# EAGLE design schematic (EAGLE 9.5.2)
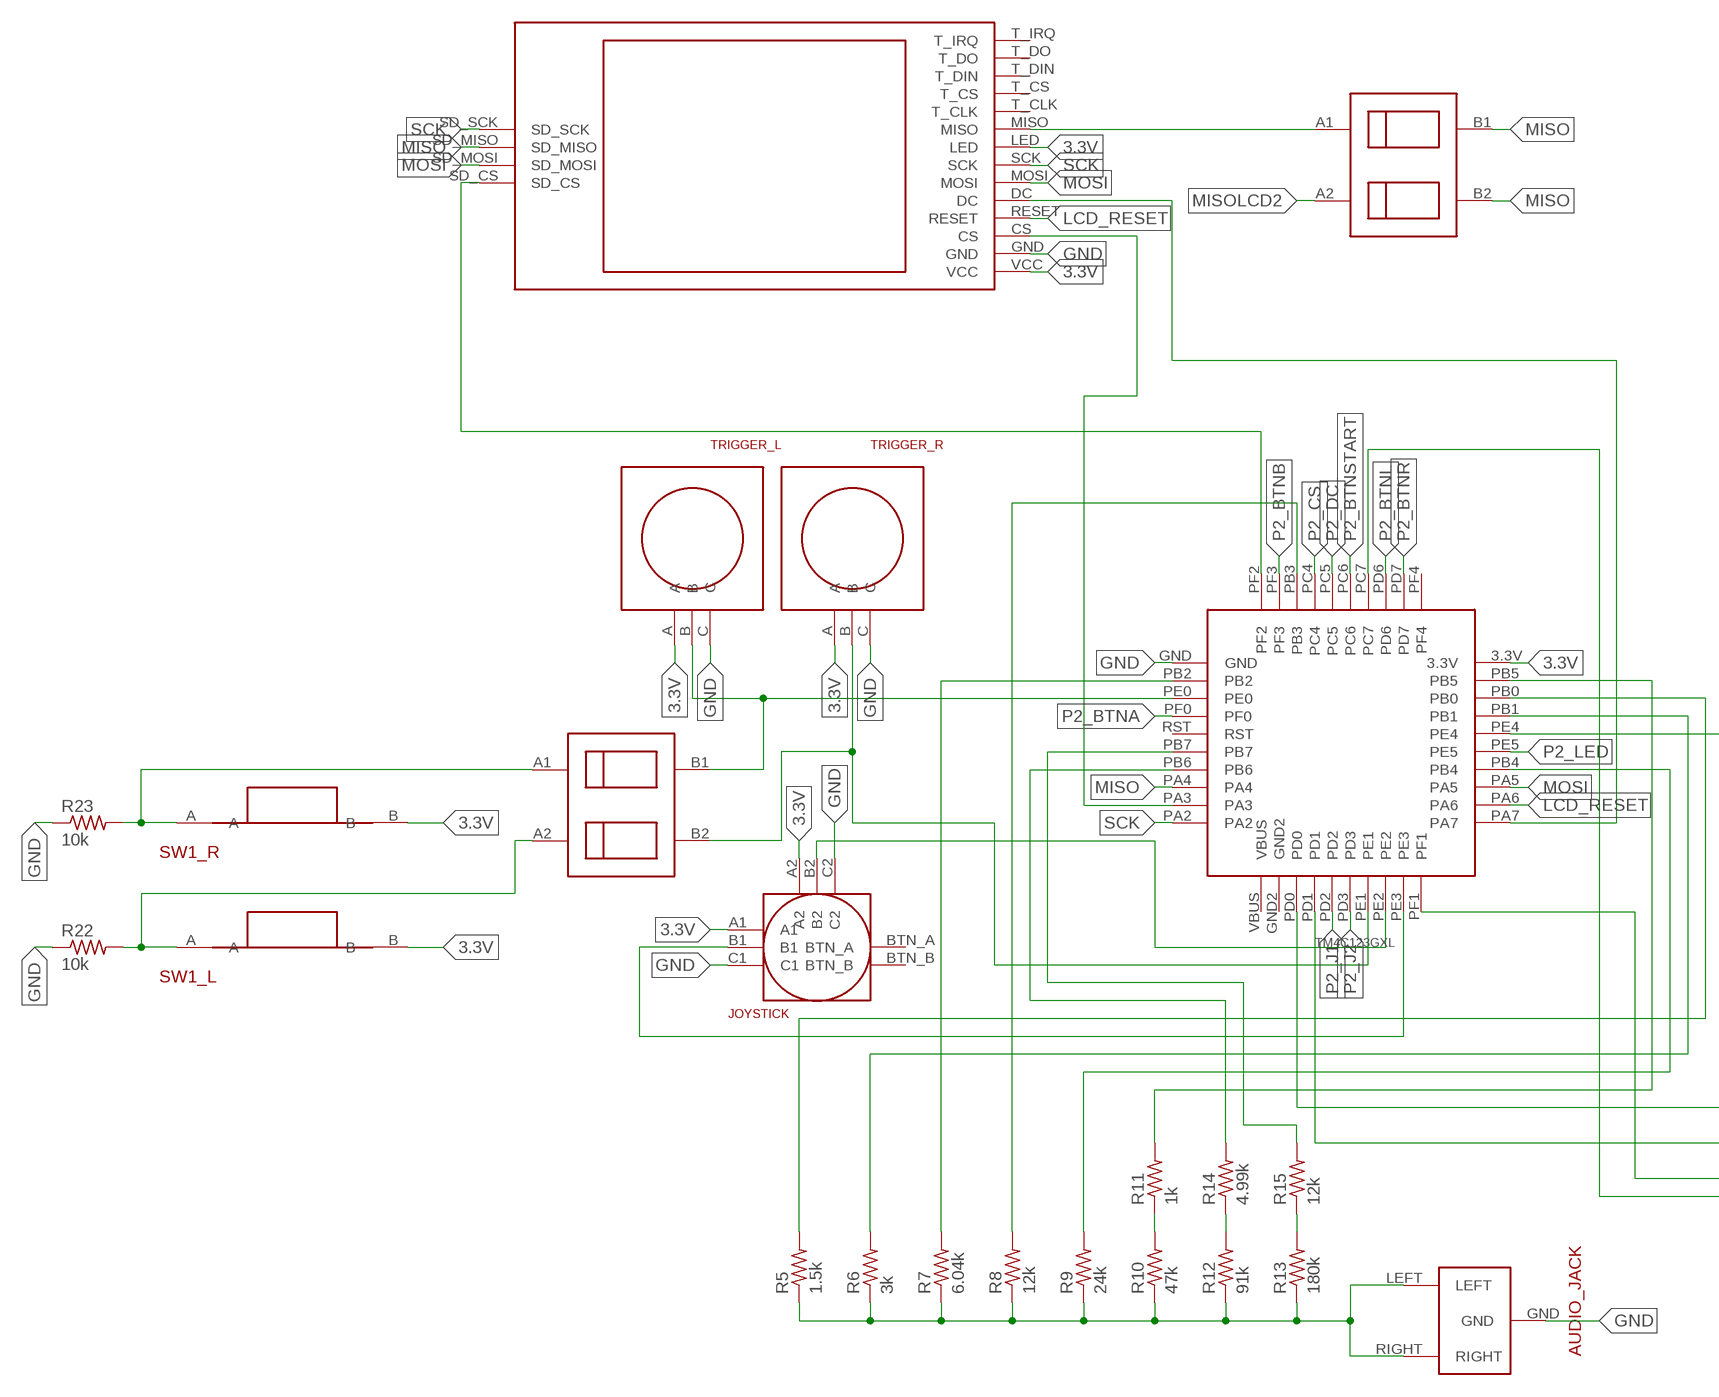
[diagram p0: schematic, sheet 1, part 1 of 2]
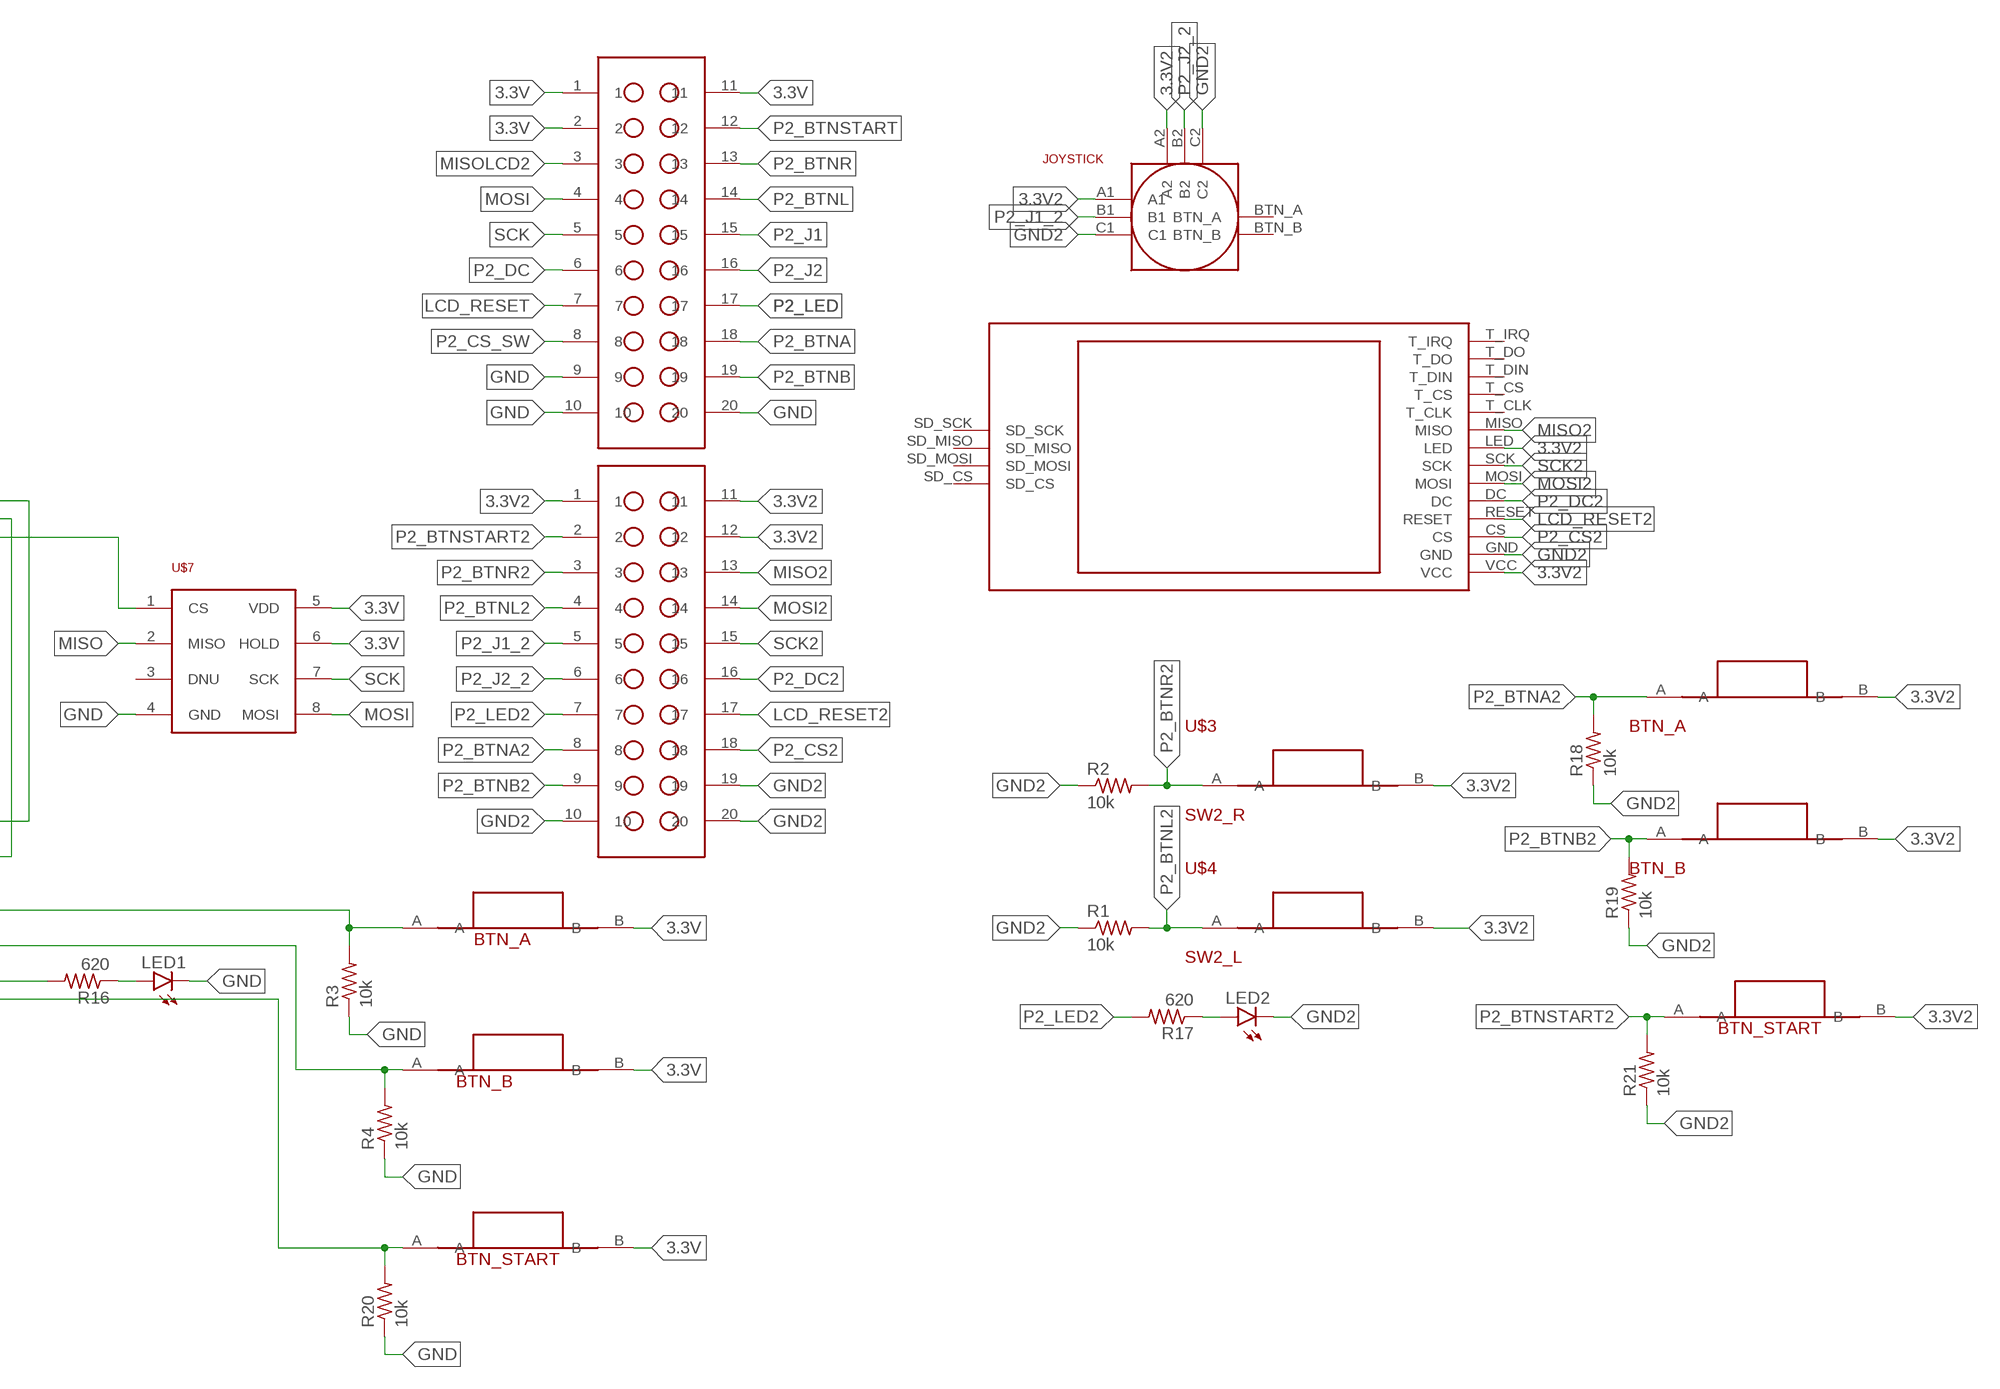
[diagram p1: schematic, sheet 1, part 2 of 2]

## Parts
LED1  LEDCHIPLED_1206  [CHIPLED_1206]
LED2  LEDCHIPLED_1206  [CHIPLED_1206]
P1_LCD  ILI9341  [ILI9341]
P2_LCD  ILI9341  [ILI9341]
R1  10k  R-US_R0805  [R0805]
R2  10k  R-US_R0805  [R0805]
R3  10k  R-US_R0805  [R0805]
R4  10k  R-US_R0805  [R0805]
R5  1.5k  R-US_R0805  [R0805]
R6  3k  R-US_R0805  [R0805]
R7  6.04k  R-US_R0805  [R0805]
R8  12k  R-US_R0805  [R0805]
R9  24k  R-US_R0805  [R0805]
R10  47k  R-US_R0805  [R0805]
R11  1k  R-US_R0805  [R0805]
R12  91k  R-US_R0805  [R0805]
R13  180k  R-US_R0805  [R0805]
R14  4.99k  R-US_R0805  [R0805]
R15  12k  R-US_R0805  [R0805]
R16  620  R-US_R0805  [R0805]
R17  620  R-US_R0805  [R0805]
R18  10k  R-US_R0805  [R0805]
R19  10k  R-US_R0805  [R0805]
R20  10k  R-US_R0805  [R0805]
R21  10k  R-US_R0805  [R0805]
R22  10k  R-US_R0805  [R0805]
R23  10k  R-US_R0805  [R0805]
U$1  TM4C123GXL  [TM4C123GXL]
U$2  JOYSTICK  [JOYSTICK]
U$3  SW2_R  SW-1825968-2  [SW-1825968-2]
U$4  SW2_L  SW-1825968-2  [SW-1825968-2]
U$5  TRIGGER_L  [TRIGGER_L]
U$6  TRIGGER_R  [TRIGGER_R]
U$7  IS62WVS5128FALL-16NLI  [SOIC127P600X144-8]
U$8  BTN_A  BUTTON  [BUTTON]
U$9  BTN_B  BUTTON  [BUTTON]
U$10  AUDIO_JACK  [AUDIO_JACK]
U$11  10X2_HEADER  [10X2_HEADER]
U$12  10X2_HEADER  [10X2_HEADER]
U$13  JOYSTICK  [JOYSTICK]
U$14  BTN_A  BUTTON  [BUTTON]
U$15  BTN_B  BUTTON  [BUTTON]
U$16  BTN_START  BUTTON  [BUTTON]
U$17  BTN_START  BUTTON  [BUTTON]
U$18  SW1_R  SW-1825968-2  [SW-1825968-2]
U$19  SW1_L  SW-1825968-2  [SW-1825968-2]
U$20  DIPSW-2  [DIPSW-2]
U$21  DIPSW-2  [DIPSW-2]

## Nets
3.3V: P1_LCD.LED P1_LCD.VCC U$1.3.3V U$2.A1 U$2.A2 U$5.A U$6.A U$7.5(VDD) U$7.6(HOLD) U$8.B U$9.B U$11.1 U$11.2 U$11.11 U$16.B U$18.B U$19.B
3.3V2: P2_LCD.LED P2_LCD.VCC U$3.B U$4.B U$12.1 U$12.11 U$12.12 U$13.A1 U$13.A2 U$14.B U$15.B U$17.B
GND: LED1.C P1_LCD.GND R3.1 R4.1 R20.1 R22.1 R23.1 U$1.GND U$2.C1 U$2.C2 U$5.C U$6.C U$7.4(GND) U$10.GND U$11.9 U$11.10 U$11.20
GND2: LED2.C P2_LCD.GND R1.1 R2.1 R18.1 R19.1 R21.1 U$12.10 U$12.19 U$12.20 U$13.C1 U$13.C2
LCD_RESET: P1_LCD.RESET U$1.PA6 U$11.7
LCD_RESET2: P2_LCD.RESET U$12.17
MISO: P1_LCD.SD_MISO U$1.PA4 U$7.2(MISO) U$21.B1 U$21.B2
MISO2: P2_LCD.MISO U$12.13
MISOLCD1: P1_LCD.MISO U$21.A1
MISOLCD2: U$11.3 U$21.A2
MOSI: P1_LCD.MOSI P1_LCD.SD_MOSI U$1.PA5 U$7.8(MOSI) U$11.4
MOSI2: P2_LCD.MOSI U$12.14
N$1: U$1.PE4 U$7.1(CS)
N$2: U$1.PE0 U$5.B U$20.B1
N$3: P1_LCD.CS U$1.PA3
N$4: U$1.PE2 U$2.B2
N$5: U$1.PE1 U$6.B U$20.B2
N$6: R16.2 U$1.PF1
N$7: R4.2 U$1.PD1 U$9.A
N$8: R10.2 R11.1
N$9: LED2.A R17.1
N$11: R12.2 R14.1
N$12: R20.2 U$1.PC7 U$16.A
N$14: P1_LCD.DC U$1.PA7
N$17: R13.2 R15.1
N$18: R5.1 R6.1 R7.1 R8.1 R9.1 R10.1 R12.1 R13.1 U$10.LEFT U$10.RIGHT
N$19: R5.2 U$1.PB0
N$20: R6.2 U$1.PB1
N$21: R7.2 U$1.PB2
N$22: R8.2 U$1.PB3
N$23: R9.2 U$1.PB4
N$24: R11.2 U$1.PB5
N$25: R14.2 U$1.PB6
N$26: R15.2 U$1.PB7
N$27: R3.2 U$1.PD0 U$8.A
N$29: LED1.A R16.1
N$30: U$1.PE3 U$2.B1
N$31: P1_LCD.SD_CS U$1.PF2
P1_BTN_L: R22.2 U$19.A U$20.A2
P1_BTN_R: R23.2 U$18.A U$20.A1
P2_BTNA: U$1.PF0 U$11.18
P2_BTNA2: R18.2 U$12.8 U$14.A
P2_BTNB: U$1.PF3 U$11.19
P2_BTNB2: R19.2 U$12.9 U$15.A
P2_BTNL: U$1.PD6 U$11.14
P2_BTNL2: R1.2 U$4.A U$12.4
P2_BTNR: U$1.PD7 U$11.13
P2_BTNR2: R2.2 U$3.A U$12.3
P2_BTNSTART: U$1.PC6 U$11.12
P2_BTNSTART2: R21.2 U$12.2 U$17.A
P2_CS: U$1.PC4
P2_CS2: P2_LCD.CS U$12.18
P2_CS_SW: U$11.8
P2_DC: U$1.PC5 U$11.6
P2_DC2: P2_LCD.DC U$12.16
P2_J1: U$1.PD2 U$11.15
P2_J1_2: U$12.5 U$13.B1
P2_J2: U$1.PD3 U$11.16
P2_J2_2: U$12.6 U$13.B2
P2_LED: U$1.PE5 U$11.17
P2_LED2: R17.2 U$12.7
SCK: P1_LCD.SCK P1_LCD.SD_SCK U$1.PA2 U$7.7(SCK) U$11.5
SCK2: P2_LCD.SCK U$12.15
Unconnected: P1_LCD.T_CLK P1_LCD.T_CS P1_LCD.T_DIN P1_LCD.T_DO P1_LCD.T_IRQ P2_LCD.SD_CS P2_LCD.SD_MISO P2_LCD.SD_MOSI P2_LCD.SD_SCK P2_LCD.T_CLK P2_LCD.T_CS P2_LCD.T_DIN P2_LCD.T_DO P2_LCD.T_IRQ U$1.GND2 U$1.PF4 U$1.RST U$1.VBUS U$2.BTN_A U$2.BTN_B U$7.3(DNU) U$13.BTN_A U$13.BTN_B

## Library data of the parts
LED1 LED2 = led:LED: LED OSRAM: - CHIPLED LG R971, LG N971, LY N971, LG Q971, LY Q971, LO R971, LY R971 LH N974, LH R974 LS Q976, LO Q976, LY Q976 LO Q996 - Hyper CHIPLED LW Q18S LB Q993, LB Q99A, LB R99A - SideLED LS A670, LO A670, LY A670, LG A670, LP A670 LB A673, LV A673, LT A673, LW A673 LH A674 LY A675 LS A676, LA A676, LO A676, LY A676, LW A676 LS A679, LY A679, LG A679 - Hyper Micro SIDELED® LS Y876, LA Y876, LO Y876, LY Y876 LT Y87S - SmartLED LW L88C, LW L88S LB L89C, LB L89S, LG L890 LS L89K, LO L89K, LY L89K LS L896, LA L896, LO L896, LY L896 - TOPLED LS T670, LO T670, LY T670, LG T670, LP T670 LSG T670, LSP T670, LSY T670, LOP T670, LYG T670 LG T671, LOG T671, LSG T671 LB T673, LV T673, LT T673, LW T673 LH T674 LS T676, LA T676, LO T676, LY T676, LB T676, LH T676, LSB T676, LW T676 LB T67C, LV T67C, LT T67C, LS T67K, LO T67K, LY T67K, LW E67C LS E67B, LA E67B, LO E67B, LY E67B, LB E67C, LV E67C, LT E67C LW T67C LS T679, LY T679, LG T679 LS T770, LO T770, LY T770, LG T770, LP T770 LB T773, LV T773, LT T773, LW T773 LH T774 LS E675, LA E675, LY E675, LS T675 LS T776, LA T776, LO T776, LY T776, LB T776 LHGB T686 LT T68C, LB T68C - Hyper Mini TOPLED® LB M676 - Mini TOPLED Santana® LG M470 LS M47K, LO M47K, LY M47K Source: http://www.osram.convergy.de LUXEON: - LUMILED® LXK2-PW12-R00, LXK2-PW12-S00, LXK2-PW14-U00, LXK2-PW14-V00 LXK2-PM12-R00, LXK2-PM12-S00, LXK2-PM14-U00 LXK2-PE12-Q00, LXK2-PE12-R00, LXK2-PE12-S00, LXK2-PE14-T00, LXK2-PE14-U00 LXK2-PB12-K00, LXK2-PB12-L00, LXK2-PB12-M00, LXK2-PB14-N00, LXK2-PB14-P00, LXK2-PB14-Q00 LXK2-PR12-L00, LXK2-PR12-M00, LXK2-PR14-Q00, LXK2-PR14-R00 LXK2-PD12-Q00, LXK2-PD12-R00, LXK2-PD12-S00 LXK2-PH12-R00, LXK2-PH12-S00 LXK2-PL12-P00, LXK2-PL12-Q00, LXK2-PL12-R00 Source: www.luxeon.com KINGBRIGHT: KA-3528ASYC Source: www.kingbright.com
P1_LCD P2_LCD = 319H Final Project:ILI9341
R1-R23 = rcl:R-US_: RESISTOR, American symbol; SPICEPREFIX: R
U$1 = 319H Final Project:TM4C123GXL
U$2 U$13 = 319H Final Project:JOYSTICK
U$3 U$4 U$18 U$19 = 319H Final Project:SW-1825968-2
U$5 = 319H Final Project:TRIGGER_L
U$6 = 319H Final Project:TRIGGER_R
U$7 = 319H Final Project:IS62WVS5128FALL-16NLI
U$8 U$9 U$14-U$17 = 319H Final Project:BUTTON
U$10 = 319H Final Project:AUDIO_JACK
U$11 U$12 = 319H Final Project:10X2_HEADER
U$20 U$21 = 319H Final Project:DIPSW-2

## Board
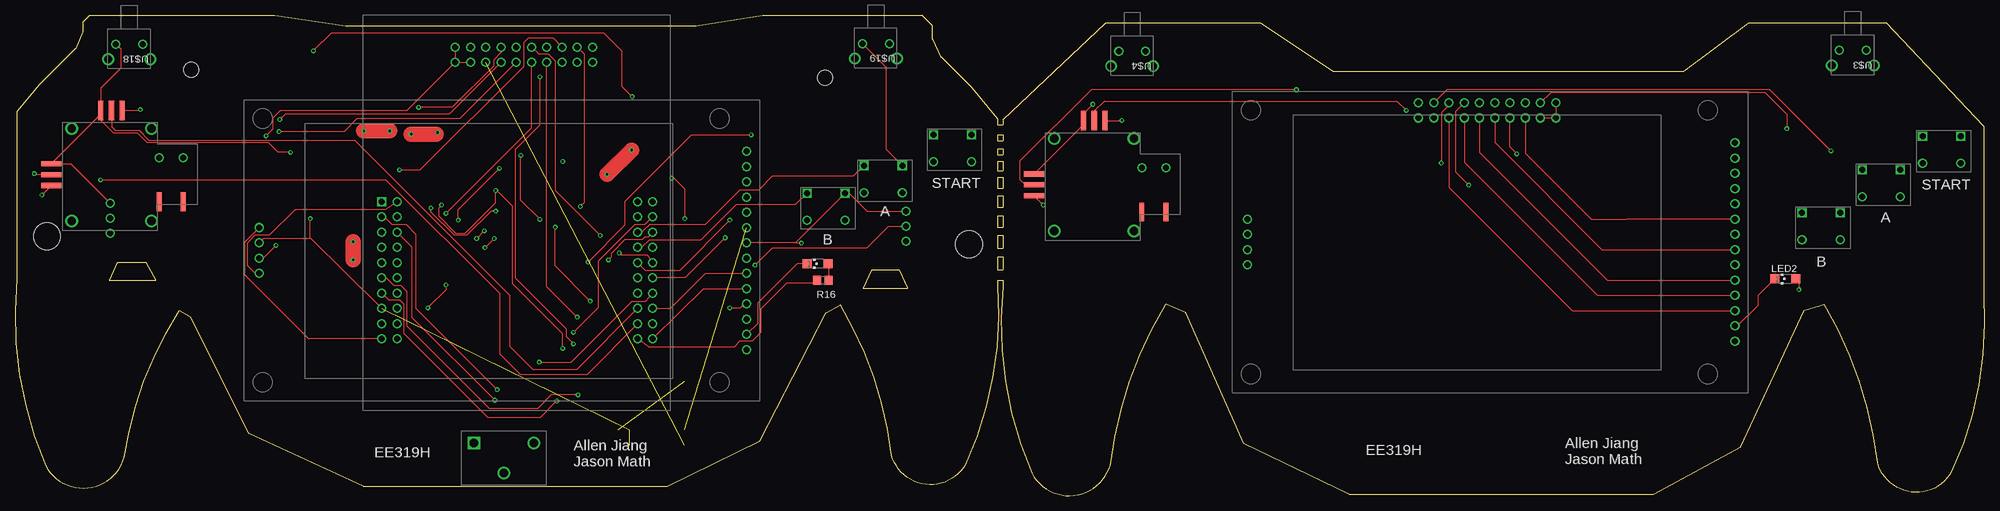
[diagram p2: board, top side]
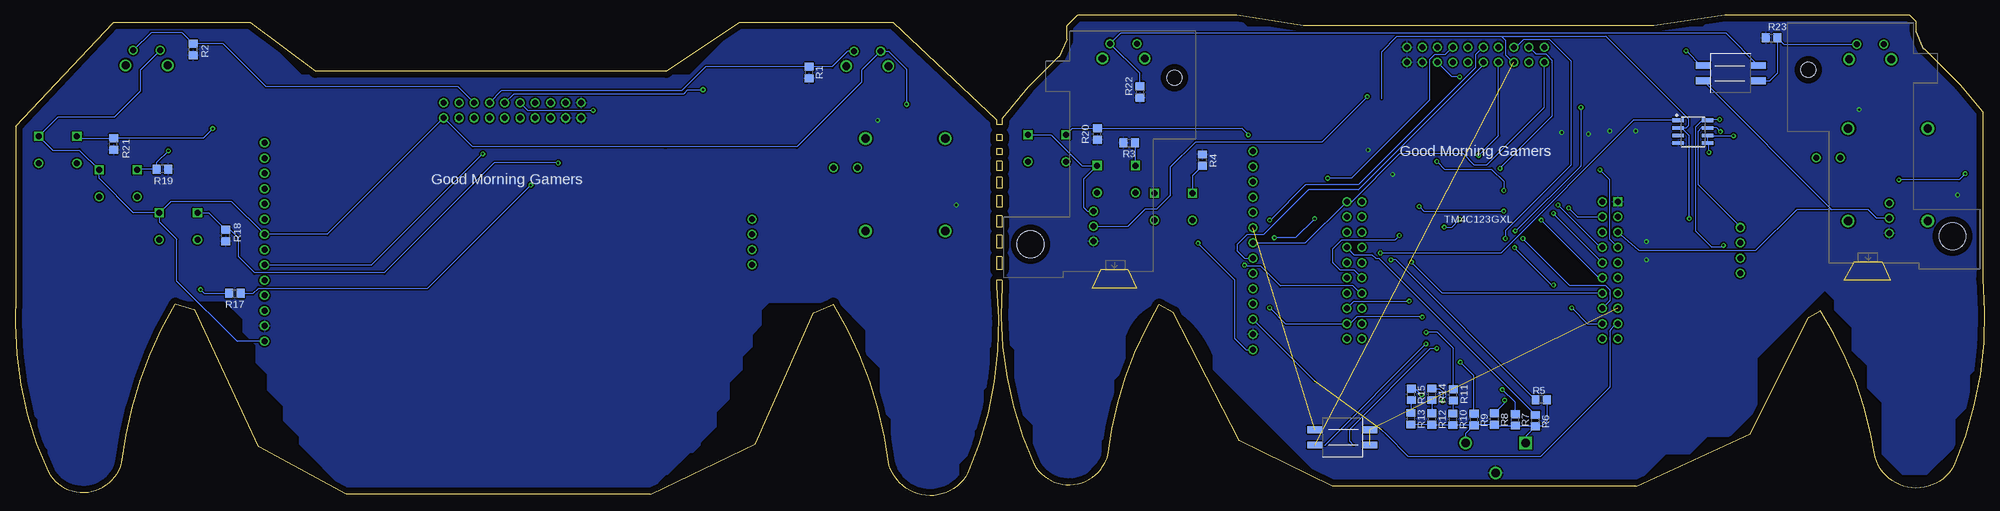
[diagram p3: board, bottom side, seen from below]

Size 327.98 x 80.03 mm. Coordinates in mm from the lower left corner, seen from the top.
Outline: 152.82,78.25 151.04,80.03 124.5,80.03 113.45,78.25 55.03,78.25 43.22,80.03 12.48,80.03 11.34,78.89 11.34,77.24 10.2,74.44 10.07,74.44 4.1,68.47 0.29,63.9 0.29,36.09 arc29 5.12,4.97 arc135 18.2,6.37 arc-24 27.34,30.75 29.25,29.74 39.03,10.31 57.95,1.54 108.62,1.54 124.12,9.16 135.04,30.5 137.45,31.77 arc-24 145.96,6.75 arc135 158.28,5.23 arc29 163.61,34.95 163.61,35.83 164.5,35.83 164.5,34.82 arc29 169.33,3.7 arc135 182.41,5.1 arc-24 191.68,31.9 194.98,30.5 204.63,8.66 222.16,0.27 272.83,0.27 287.44,8.15 297.98,30.88 301.28,31.9 arc-24 310.17,5.48 arc135 322.49,3.96 arc29 327.82,33.68 327.82,61.49 311.65,78.76 288.71,78.76 277.91,70.63 219.49,70.63 207.43,78.76 181.65,78.76 164.5,62.63 164.5,61.74 163.61,61.74 163.61,62.76 159.29,67.97 154.21,73.05 154.09,73.05 152.82,75.97 152.82,78.25
Outline: 163.61,60.09 163.61,59.08 164.5,59.08 164.5,60.09 163.61,60.09
Outline: 163.61,57.81 163.61,56.79 164.5,56.79 164.5,57.81 163.61,57.81
Outline: 163.61,55.65 163.61,54.12 164.5,54.12 164.5,55.65 163.61,55.65
Outline: 163.61,52.98 163.61,51.2 164.5,51.2 164.5,52.98 163.61,52.98
Outline: 163.61,49.93 163.61,48.03 164.5,48.03 164.5,49.93 163.61,49.93
Outline: 163.61,46.63 163.61,44.72 164.5,44.72 164.5,46.63 163.61,46.63
Outline: 163.61,43.33 163.61,41.17 164.5,41.17 164.5,43.33 163.61,43.33
Outline: 163.61,39.77 163.61,37.61 164.5,37.61 164.5,39.77 163.61,39.77
Copper layers (1*16): Top 0.035mm / dielectric 1.5mm / Bottom 0.035mm
Design rules "default *": minimum track width 6mil, minimum drill 0.35mm, track to track 10mil, track to pad 10mil, pad to pad 10mil, via to via 10mil, smd to smd 10mil, copper to edge 40mil, drill to drill 6mil, minimum pad ring 10mil, minimum via ring 8mil, stop-mask expansion 4mil, vias tented up to drill 0mil, thermal gap 10mil
Milling: 8 lines

### Footprints (pad centres in the part's own frame; a part is rotated, then mirrored left to right if it is on the bottom)
CHIPLED_1206 = smd 1.5 x 1.5: A 0,-1.75; C 0,1.75
ILI9341 = drill 1: CS 83.713,13.635; DC 83.713,18.715; GND 83.713,11.095; LED 83.713,26.335; MISO 83.713,28.875; MOSI 83.713,21.255; RESET 83.713,16.175; SCK 83.713,23.795; SD_CS 2.538,21.261; SD_MISO 2.538,26.341; SD_MOSI 2.538,23.801; SD_SCK 2.538,28.881; T_CLK 83.713,31.415; T_CS 83.713,33.955; T_DIN 83.713,36.495; T_DO 83.713,39.035; T_IRQ 83.713,41.575; VCC 83.713,8.555
R0805 = smd 1.3 x 1.5: 1 -0.95,0; 2 0.95,0
TM4C123GXL = drill 1: 3.3V 21.367,-0.127; GND2 18.827,-2.667; PA2 -23.749,-22.987; PA3 -23.749,-20.447; PA4 -23.749,-17.907; PA5 21.367,-17.907; PA6 21.367,-20.447; PA7 21.367,-22.987; PB0 21.367,-5.207; PB1 21.367,-7.747; PB2 -23.749,-2.667; PB3 -21.209,-5.207; PB4 21.367,-15.367; PB5 21.367,-2.667; PB6 -23.749,-15.367; PB7 -23.749,-12.827; PC4 -21.209,-7.747; PC5 -21.209,-10.287; PC6 -21.209,-12.827; PC7 -21.209,-15.367; PD0 18.827,-5.207; PD1 18.827,-7.747; PD2 18.827,-10.287; PD3 18.827,-12.827; PD6 -21.209,-17.907; PD7 -21.209,-20.447; PE0 -23.749,-5.207; PE1 18.827,-15.367; PE2 18.827,-17.907; PE3 18.827,-20.447; PE4 21.367,-10.287; PE5 21.367,-12.827; PF0 -23.749,-7.747; PF1 18.827,-22.987; PF2 -21.209,-0.127; PF3 -21.209,-2.667; PF4 -21.209,-22.987; RST -23.749,-10.287; VBUS 18.827,-0.127 | drill 1 square: GND -23.749,-0.127
JOYSTICK = smd 3.3 x 0.86: A1 -10.3,1.72; B1 -10.3,-0.08; C1 -10.3,-1.88 | smd 0.86 x 3.3: A2 -2.075,10.62; B2 -0.275,10.62; C2 1.525,10.62 | smd 0.8 x 3.1: BTN_A 7.65,-4.58; BTN_B 11.65,-4.58 | drill 1.4: P$1 6.35,7.62; P$2 -6.9,7.62; P$3 6.35,-7.78; P$4 -6.9,-7.78 | drill 1: P$11 7.65,2.77; P$12 11.65,2.77
SW-1825968-2 = drill 1.295: 3 -3.2,2.54; 4 3.81,2.54 | drill 1: A -1.93,0.051; B 2.54,0.051
TRIGGER_L = drill 1: A 1.27,-7.7; B 1.27,-10.2; C 1.27,-12.7 | hole 2.5: -12.23,14.5 | hole 4.5: 11.77,-13.2
TRIGGER_R = drill 1: A -3.81,-7.7; B -3.81,-10.2; C -3.81,-12.7 | hole 2.5: 9.69,14.5 | hole 4.5: -14.31,-13.2
SOIC127P600X144-8 = smd 1.901 x 0.599: 1 -2.455,1.905; 2 -2.455,0.635; 3 -2.455,-0.635; 4 -2.455,-1.905; 5 2.455,-1.905; 6 2.455,-0.635; 7 2.455,0.635; 8 2.455,1.905
BUTTON = drill 1 square: A -3.81,2.54; B 2.54,2.54 | drill 1: P$3 -3.81,-1.96; P$4 2.54,-1.96
AUDIO_JACK = drill 1.4: GND 0,-2.54; LEFT 5,2.46 | drill 1.4 square: RIGHT -5,2.46
10X2_HEADER = drill 1: 1 -1.27,11.557; 2 -1.27,9.017; 3 -1.27,6.477; 4 -1.27,3.937; 5 -1.27,1.397; 6 -1.27,-1.143; 7 -1.27,-3.683; 8 -1.27,-6.223; 9 -1.27,-8.763; 10 -1.27,-11.303; 11 1.27,11.557; 12 1.27,9.017; 13 1.27,6.477; 14 1.27,3.937; 15 1.27,1.397; 16 1.27,-1.143; 17 1.27,-3.683; 18 1.27,-6.223; 19 1.27,-8.763; 20 1.27,-11.303
DIPSW-2 = smd 1.12 x 2.44: A1 -1.805,-5.08; A2 0.735,-5.08; B1 -1.805,4.14; B2 0.735,4.14

### Placement (x,y rotation side)
LED1  133.64,38.63 90 top
LED2  294.8,36.09 90 top
P1_LCD  38.14,15.77 0 top
P2_LCD  202.73,17.17 0 top
R1  195.73,70.46 90 bottom
R2  298.3,74.3 90 bottom
R3  142.42,58.74 0 bottom
R4  130.26,55.87 270 bottom
R5  73.81,16.01 180 bottom
R6  74.77,12.49 90 bottom
R7  78.15,12.63 90 bottom
R8  81.63,12.78 90 bottom
R9  84.99,12.7 90 bottom
R10  88.5,12.74 90 bottom
R11  88.48,16.8 90 bottom
R12  91.99,12.77 90 bottom
R13  95.48,12.82 90 bottom
R14  91.99,16.9 90 bottom
R15  95.47,16.88 90 bottom
R16  134.53,35.83 180 top
R17  291.37,33.68 0 bottom
R18  292.9,43.33 90 bottom
R19  303.44,54.38 180 bottom
R20  147.74,60.22 90 bottom
R21  311.57,58.57 90 bottom
R22  140.63,67.2 90 bottom
R23  35.47,76.22 0 bottom
U$1  84.84,49.1 0 top
U$2  16.34,53.53 0 top
U$3  306.36,74.19 180 top
U$4  186.35,74.06 180 top
U$5  17.09,56.4 0 bottom
U$6  144.57,55.06 0 bottom
U$7  48.55,60.6 0 bottom
U$8  145.22,52.43 0 top
U$9  135.71,47.83 0 top
U$10  81.42,6.32 0 top
U$11  84.87,73.43 90 top
U$12  245.02,64.16 270 top
U$13  180,51.84 0 top
U$14  301.41,44.6 0 top
U$15  311.44,51.71 0 top
U$16  156.75,57.55 0 top
U$17  321.47,57.3 0 top
U$18  19.34,75.2 180 top
U$19  143.67,75.33 180 top
U$20  42.71,70.89 90 bottom
U$21  106.46,9.16 270 bottom

### Tracks (layer width: path | path; a pad name or v marks a point on that pad's centre or on a via)
3.3V  (via drill 0.35)
  Top 0.152: U$5.A 9.28,55.25 U$2.A1 14.27,63.47 U$2.A2 | 129.99,42.1 U$9.B 138.92,50.37 141.92,47.36 U$6.A | 129.99,42.1 P1_LCD.LED | v45.88,57.17 43.85,57.17 42.23,58.8 22,58.8 20.45,60.35 16.42,60.35 14.27,62.5 U$2.A2 | v41.82,59.91 42.96,61.05 42.96,62.89 44.23,64.16 65.31,64.16 U$11.1 | 129.99,42.1 130.93,42.1 v130.97,42.06 | U$11.11 U$11.1 | U$11.1 U$11.2 | U$19.B 145.07,71.34 145.07,57.67 U$8.B | U$18.B 17.56,74.39 17.56,71.14 14.27,67.84 U$2.A2
  Bottom 0.152: U$6.A 149.36,47.36 150.02,48.03 150.02,52.71 U$8.B 150.3,54.97 155.42,60.09 U$16.B | v45.88,57.17 45.88,58.48 U$7.5 U$7.6 46.02,59.89 43.69,59.89 43.67,59.91 v41.82,59.91 | P1_LCD.LED 113.08,42.1 U$1.3.3V 105.39,48.98 97.32,57.04 86.9,57.04 85,55.14 82.84,55.14 73.32,64.66 U$11.1 | v130.97,42.06 124.88,35.96 124.88,26.18 123.02,24.32 P1_LCD.VCC
3.3V2  (via drill 0.35)
  Top 0.152: U$13.A1 177.92,61.78 U$13.A2 177.92,63.6 v179.49,65.17 | U$12.1 U$12.11 U$12.12
  Bottom 0.152: P2_LCD.VCC 291.01,25.72 301.03,35.73 301.03,42.69 303.95,45.61 303.95,47.01 | 303.95,47.01 U$14.B 308.27,47.14 313.98,52.85 U$15.B 317.28,57.55 321.73,57.55 U$17.B 320.84,63.01 311.44,63.01 307.12,67.33 307.12,70.84 U$3.B | 303.95,47.01 302.04,48.92 291.86,48.92 P2_LCD.LED 275.96,43.5 U$12.11 251.75,58.06 219.75,58.06 219.62,58.06 197.78,58.06 186.98,68.85 186.98,70.84 U$4.B 182.48,74.01 179.49,71.01 v179.49,65.17
GND  (via drill 0.35)
  Top 0.152: LED1.C 130.24,38.63 123.63,32.02 123.63,28.64 P1_LCD.GND | U$2.C1 6.04,51.62 v4.48,50.06 | U$2.C2 20.73,64.15 v20.86,64.28 | v70.39,60.47 70.14,60.22
  Top 2.54: v58.08,60.73 v62.39,60.73 | v56.3,42.31 v56.3,39.26 | v102.65,57.55 v98.59,53.49 | 70.14,60.22 v65.95,60.22
  pour Bottom: 0.8,63.65 0.8,21.86 2.58,20.09 2.58,15.13 4.99,12.72 4.99,8.15 9.69,3.45 13.63,3.45 17.05,6.88 17.05,15.51 19.47,17.93 19.47,21.61 22.01,24.15 22.01,27.96 24.93,30.88 24.93,32.53 26.58,34.18 37.88,22.88 37.88,14.37 42.45,9.8 46.26,9.8 49.19,6.88 53.12,6.88 58.2,1.8 109.26,1.8 128.43,20.98 128.43,23.26 arc-50 137.45,32.28 arc-50 143.17,26.56 143.17,21.1 145.07,19.2 145.07,14.63 146.09,13.61 146.09,10.18 147.1,9.16 147.1,6.24 150.66,2.69 154.47,2.69 158.41,6.62 158.41,11.7 161.45,14.75 161.45,24.28 162.98,25.8 162.98,63.65 152.44,74.19 152.44,78.13 150.79,79.78 124.5,79.78 122.79,78.07 46.83,78.07 45.38,79.52 12.1,79.52 11.59,79.01 11.59,75.46 2.45,66.31 2.45,65.3
GND2  (via drill 0.35)
  Top 0.152: U$13.C1 v171.23,48.41 | U$13.C2 184.27,62.46 v184.31,62.5 | LED2.C 290.23,33.27 290.23,31.64 286.85,28.26 P2_LCD.GND
  pour Bottom: 181.52,78.25 165.26,62 165.26,25.04 165.77,24.53 165.77,18.56 166.79,17.55 166.79,12.34 168.31,10.82 168.31,7.77 170.85,5.23 170.85,2.31 172.12,2.31 173.39,1.04 178.09,1.04 182.03,4.97 182.03,12.72 183.81,14.5 183.81,21.23 186.22,23.64 186.22,27.58 190.79,32.15 202.47,32.15 203.74,30.88 203.74,28.34 205.27,26.82 205.27,24.79 206.92,23.13 206.92,20.98 209.08,18.82 209.08,16.02 211.24,13.86 211.24,11.45 213.9,8.78 213.9,8.4 215.17,7.13 215.68,7.13 219.37,3.45 219.62,3.45 222.29,0.78 272.83,0.78 280.58,8.53 280.58,9.8 283.25,12.47 283.25,14.88 285.91,17.55 285.91,20.21 287.82,22.12 287.82,25.04 289.98,27.2 289.98,29.36 293.03,32.41 301.15,32.41 303.31,30.25 303.31,29.1 304.46,27.96 304.46,26.82 305.47,25.8 305.47,24.4 306.49,23.39 306.49,22.25 307.12,21.61 307.12,20.47 308.14,19.45 308.14,17.55 308.77,16.91 308.77,14.37 309.66,13.48 309.66,10.69 310.17,10.18 310.17,7.64 310.81,7.01 310.81,4.85 312.2,3.45 312.2,2.81 313.22,1.8 313.35,1.8 313.6,1.54 319.19,1.54 322.49,4.85 322.49,7.64 324.14,9.29 324.14,12.72 325.92,14.5 325.92,19.32 326.93,20.34 326.93,30.75 327.57,31.39 327.57,61.49 310.55,78.51 288.71,78.51 280.33,70.12 215.56,70.12 207.43,78.25
LCD_RESET  (via drill 0.35)
  Top 0.152: v119.04,31.26 120.81,31.26 121.49,31.94 P1_LCD.RESET | v93.64,29.74 88.56,34.82 U$11.7
  Bottom 0.152: v119.04,31.26 116.43,28.66 U$1.PA6 105.64,28.66 104.43,29.87 93.76,29.87 v93.64,29.74
LCD_RESET2
  Top 0.152: P2_LCD.RESET 263.52,33.34 241.34,55.52 U$12.17
MISO  (via drill 0.35)  (2 unrouted)
  Top 0.152: U$1.PA4 49.29,42.74 | 49.29,42.74 41.31,42.74 P1_LCD.SD_MISO | 49.29,42.74 49.19,42.85 v49.19,46.12
  Bottom 0.152: v49.19,46.12 49.19,59.96 50.43,61.21 50.98,61.21 U$7.2 49.69,61.23 49.31,61.62 49.31,62.76 63.03,76.47 80.43,76.47 | 100.37,66.13 100.37,73.93 97.83,76.47 80.43,76.47 | 80.43,76.47 79.79,75.84 79.79,73.43 78.52,72.16
MISO2
  Top 0.152: P2_LCD.MISO 269.02,46.04 268.34,46.04 262.5,46.04 251.5,57.04 U$12.13
MISOLCD1  (1 unrouted)
MISOLCD2  (1 unrouted)
MOSI  (via drill 0.35)
  Top 0.152: P1_LCD.MOSI 114.99,37.02 109.16,31.2 U$1.PA5 | v43.47,41.68 41.36,39.57 P1_LCD.SD_MOSI | v95.79,32.41 89.95,38.25 v89.95,44.72 | v87.41,45.99 84.24,49.17 v84.24,56.66 | U$11.4 72.3,63.52 44.99,63.52 v44.11,62.63
  Bottom 0.152: v43.47,41.68 43.72,41.42 45.5,41.42 48.17,44.09 48.17,61.36 47.03,62.5 U$7.8 45.97,62.63 v44.11,62.63 | U$1.PA5 105,32.41 v95.79,32.41 | v89.95,44.72 88.68,44.72 v87.41,45.99 | v84.24,56.66 80.94,59.96 U$11.4
MOSI2  (via drill 0.35)
  Top 0.152: v250.1,56.92 248.96,58.06 U$12.14
  Bottom 0.152: P2_LCD.MOSI 268.6,38.42 v250.1,56.92
N$1  (via drill 0.35)
  Top 0.152: v100.62,40.41 101.01,40.02 105.32,40.02 U$1.PE4
  Bottom 0.152: U$7.1 58.46,62.5 80.55,40.41 v100.62,40.41
N$2
  Bottom 0.152: U$5.B 17.9,46.2 19.34,47.65 25.41,47.65 | U$1.PE0 57.47,40.79 38.14,40.79 31.28,47.65 25.41,47.65 | U$20.B1 25.41,47.65
N$3  (1 unrouted)
  Bottom 0.152: P1_LCD.CS 111.54,19.1 | U$1.PA3 61.47,28.66 62.39,27.45 62.39,18.05 73.95,6.5 95.92,6.5 99.54,10.12 100.39,10.97
N$4
  Top 0.152: U$1.PE2 93.54,20.98 86.27,20.98 82.46,24.79 82.46,33.29 56.55,59.2 22.29,59.2 20.64,60.85 16.67,60.85 16.07,61.46 U$2.B2
N$5  (via drill 0.35)
  Top 0.152: v123.23,38.37 126.15,41.3 141.9,41.3 145.46,44.86 U$6.B | v102.78,66.44 101.13,68.09 101.13,74.04 98.14,77.03 52.66,77.03 v49.69,74.06
  Bottom 0.152: U$1.PE1 104.11,33.86 105.19,34.95 117.26,34.95 120.56,38.25 123.1,38.25 v123.23,38.37 | U$6.B 142.65,44.86 139.74,47.77 137.83,47.77 135.55,50.06 135.55,54.76 131.35,58.95 110.27,58.95 v102.78,66.44 | v49.69,74.06 47.25,71.62 U$20.B2
N$6
  Top 0.152: U$1.PF1 103.79,26.12 105.47,24.79 119.8,24.79 120.69,25.67 122.72,25.67 124.24,27.2 124.24,31.14 128.56,35.45 133.2,35.45 R16.2
N$7
  Top 0.152: U$9.A 129.94,48.41 120.05,48.41 114.21,42.57 105.62,42.57 104.32,41.36 U$1.PD1
  Bottom 0.152: R4.2 131.9,53.27 U$9.A
N$8
  Bottom 0.152: R11.1 88.5,15.83 R10.2
N$9  (via drill 0.35)
  Top 0.152: LED2.A 297.09,35.55 v297.09,34.31
  Bottom 0.152: v297.09,34.31 296.45,33.68 R17.1
N$11
  Bottom 0.152: R14.1 R12.2
N$12  (via drill 0.35)
  Top 0.152: v95.41,38.88 101.64,45.11 101.64,49.04 112.69,60.09 v122.59,60.09
  Bottom 0.152: U$16.A 151.87,61.17 R20.2 123.67,61.17 v122.59,60.09 | U$1.PC7 90.27,33.74 v95.41,38.88
N$14
  Top 0.152: P1_LCD.DC 114.67,34.48 U$1.PA7
N$17
  Bottom 0.152: R15.1 95.48,15.91 R13.2
N$18
  Bottom 0.152: R6.1 78.01,11.54 R7.1 81.48,11.68 R8.1 84.91,11.83 R9.1 | R9.1 88.46,11.75 R10.1 91.96,11.79 R12.1 95.43,11.82 R13.1 | R6.1 76.42,9.89 U$10.RIGHT | R9.1 86.42,10.32 U$10.LEFT | R5.1 72.86,12.41 73.73,11.54 R6.1
N$19  (via drill 0.35)
  Top 0.152: v98.84,39.26 99.35,39.77 99.35,40.41 101.64,42.69 104.52,42.69 104.93,43.1 105.5,43.1 U$1.PB0
  Bottom 0.152: R5.2 98.01,39.26 v98.84,39.26
N$20
  Bottom 0.152: R6.2 100.86,39.53 101.37,39.53 101.99,40.15 105,40.15 U$1.PB1
N$21  (via drill 0.35)
  Top 0.152: v80.3,17.67 66.84,31.14 66.84,43.45 65.19,45.11 62.77,45.11 61.44,46.44 U$1.PB2
  Bottom 0.152: R7.2 78.15,15.52 v80.3,17.67
N$22  (via drill 0.35)
  Top 0.152: v79.92,15.9 66.08,29.74 66.08,41.45 U$1.PB3
  Bottom 0.152: R8.2 79.92,15.43 v79.92,15.9
N$23  (via drill 0.35)
  Top 0.152: v87.29,22.25 92.62,22.25 102.78,32.41 104.99,32.41 U$1.PB4
  Bottom 0.152: R9.2 84.99,19.95 v87.29,22.25
N$24  (via drill 0.35)
  Top 0.152: U$1.PB5 104.88,45.11 103.99,45.11 103.16,45.11 97.06,39.01 97.06,31.26 v93,27.2
  Bottom 0.152: R11.2 88.48,24.59 91.1,27.2 v93,27.2
N$25  (via drill 0.35)
  Top 0.152: v90.21,15.77 87.41,12.97 78.78,12.97 64.81,26.94 64.81,31.9 64.17,32.53 62.27,32.53 61.09,33.71 U$1.PB6
  Bottom 0.152: R14.2 90.76,17.85 90.21,17.29 v90.21,15.77
N$26  (via drill 0.35)
  Top 0.152: v93.76,16.78 89.32,16.78 87.03,14.5 79.03,14.5 65.31,28.21 65.31,33.93 64.3,34.95 63.16,34.95 63.03,35.07 61.82,36.28 U$1.PB7
  Bottom 0.152: R15.2 94.8,17.83 v93.76,16.78
N$27
  Top 0.152: U$8.A 139.67,53.23 126.15,53.23 123.89,50.97 120.77,50.97 115.03,45.23 105.8,45.23 104.56,44.08 104.38,43.9 U$1.PD0
  Bottom 0.152: R3.2 141.47,55.04 U$8.A
N$29
  Top 0.152: LED1.A 135.48,38.54 R16.1
N$30  (via drill 0.35)
  Top 0.152: U$2.B1 3.38,53.45 v3.21,53.61 | U$1.PE3 95.32,20.21 84.11,20.21 80.68,23.64 80.68,33.68 61.76,52.6 v14.26,52.6
  Bottom 0.152: v3.21,53.61 4.23,52.6 v14.26,52.6
N$31
  Top 0.152: U$1.PF2 61.67,47.65 46.65,47.65 42.33,43.33 39.93,43.33 38.64,42.04 38.64,38.37 39.99,37.03 P1_LCD.SD_CS
P1_BTN_L
  Bottom 0.152: U$20.A2 42.99,76.98 143.9,76.98 U$19.A 140.63,70.3 R22.2
P1_BTN_R
  Bottom 0.152: R23.2 34.42,76.12 | 34.42,76.12 33.45,75.15 U$18.A | U$20.A1 35.75,69.08 34.42,70.41 34.42,76.12
P2_BTNA  (via drill 0.35)
  Top 0.152: v64.04,54.25 67.47,54.25 84.75,71.52 84.75,75.46 85.51,76.22 89.57,76.22 U$11.18
  Bottom 0.152: U$1.PF0 62.39,42.66 62.39,52.6 v64.04,54.25
P2_BTNA2  (via drill 0.35)
  Top 0.152: U$12.8 238.8,65.04 237.53,63.77 v237.53,55.39
  Bottom 0.152: U$14.A 295.76,47.14 R18.2 292.14,44.28 290.71,42.85 290.74,42.82 290.74,39.77 288.07,37.1 266.48,37.1 248.19,55.39 v237.53,55.39
P2_BTNB  (via drill 0.35)
  Top 0.152: U$11.19 94.78,73.55 94.78,48.79 v94.14,48.15 | v80.05,47.39 79.28,47.39 75.22,43.33 73.19,43.33 69.25,47.26 v69.25,47.9
  Bottom 0.152: v94.14,48.15 93.38,47.39 v80.05,47.39 | v69.25,47.9 67.79,46.44 U$1.PF3
P2_BTNB2  (via drill 0.35)
  Top 0.152: U$12.9 238.54,67.71 292.14,67.71 v302.42,57.42
  Bottom 0.152: R19.2 304.46,54.38 | 304.46,54.38 307.5,54.38 U$15.A | v302.42,57.42 304.46,55.39 304.46,54.38
P2_BTNL  (via drill 0.35)
  Top 0.152: U$11.14 80.94,73.81 79.67,72.54 79.67,71.52 72.81,64.66 v67.22,64.66 | v78.14,44.09 v76.87,42.82
  Bottom 0.152: v67.22,64.66 67.22,54.88 78.01,44.09 v78.14,44.09 | v76.87,42.82 69.12,35.07 63.16,35.07 62.39,34.31 62.39,32.43 U$1.PD6
P2_BTNL2
  Bottom 0.152: U$12.4 246.99,67.39 217.02,67.39 213.08,71.33 213,71.41 R1.2 191.91,71.41 189.32,74.01 U$4.A
P2_BTNR  (via drill 0.35)
  Top 0.152: v79.79,42.82 v78.27,41.3 | v71.79,35.07 71.79,34.31 v68.74,31.26
  Bottom 0.152: U$11.13 78.01,74.7 76.74,75.97 72.43,75.97 68.87,72.41 68.87,55.01 79.79,44.09 v79.79,42.82 | v78.27,41.3 72.05,35.07 v71.79,35.07 | v68.74,31.26 66.14,28.66 U$1.PD7
P2_BTNR2
  Bottom 0.152: U$12.3 254.16,68.09 286.17,68.09 293.33,75.25 R2.2 300.15,77.11 305.32,77.11 U$3.A
P2_BTNSTART  (via drill 0.35)
  Top 0.152: v80.68,54.5 73.82,47.65 v73.82,45.87
  Bottom 0.152: U$11.12 74.71,73.55 73.06,73.55 72.05,72.54 72.05,63.14 v80.68,54.5 | v73.82,45.87 64.23,36.28 U$1.PC6
P2_BTNSTART2  (via drill 0.35)
  Top 0.152: U$12.2 255.81,67.2 291.37,67.2 295.06,63.52 v295.06,61.11
  Bottom 0.152: U$17.A 317.34,59.52 R21.2 296.65,59.52 v295.06,61.11
P2_CS  (via drill 0.35)
  Top 0.152: v91.22,24.53 91.22,26.94 82.84,35.33 82.84,48.15 80.17,50.82 v80.05,50.82 80.05,48.81 74.97,43.73 73.42,43.73 70.52,46.63 70.52,47.9 v71.03,48.41
  Bottom 0.152: v91.22,55.65 89.95,54.38 82.08,54.38 80.05,52.34 v80.05,50.82 | v71.03,48.41 63.98,41.36 U$1.PC4 | 105.09,8.43 105.7,9.04 105.7,11.07 92.24,24.53 v91.22,24.53
P2_CS2
  Top 0.152: P2_LCD.CS 259.32,30.8 238.8,51.33 U$12.18
P2_CS_SW  (via drill 0.35)
  Top 0.152: v93,25.29 91.86,26.44 91.86,27.71 83.35,36.22 83.35,57.68 87.41,61.74 v87.41,69.74
  Bottom 0.152: 109.86,8.43 v93,25.29 | v87.41,69.74 88.68,69.74 U$11.8
P2_DC  (via drill 0.35)
  Top 0.152: v71.79,47.01 86.02,61.23 U$11.6
  Bottom 0.152: U$1.PC5 71.79,46.98 v71.79,47.01
P2_DC2
  Top 0.152: P2_LCD.DC 265.17,35.88 243.88,57.17 U$12.16
P2_J1  (via drill 0.35)
  Top 0.152: v119.04,45.87 110.65,37.49 105,37.49 U$1.PD2
  Bottom 0.152: U$11.15 84.75,73.43 84.75,71.27 104.28,51.73 113.07,51.73 118.93,45.87 v119.04,45.87
P2_J1_2  (via drill 0.35)
  Top 0.152: v213.4,67.58 179.23,67.58 167.3,55.65 167.3,52.73 168.26,51.76 U$13.B1
  Bottom 0.152: U$12.5 244.89,66.95 216.57,66.95 215.94,67.58 v213.4,67.58
P2_J2  (via drill 0.35)
  Top 0.152: v97.45,43.33 89.95,50.82 89.95,72.41 88.81,73.55 87.16,73.55 U$11.16
  Bottom 0.152: v97.45,43.33 98.21,42.57 107.1,42.57 108.62,41.04 108.62,38.88 107.35,37.61 105,37.61 U$1.PD3
P2_J2_2  (via drill 0.35)
  Top 0.152: U$13.B2 179.72,64.01 181.39,65.68 230.16,65.68 v231.68,64.16
  Bottom 0.152: U$12.6 242.61,64.16 v231.68,64.16
P2_LED  (via drill 0.35)
  Top 0.152: v109.38,52.85 109.76,52.85 111.54,51.07 v111.54,46.12 | v118.27,42.95 111.6,36.28 U$1.PE5
  Bottom 0.152: v109.38,52.85 105.45,52.85 92.43,65.87 92.43,72.6 91.6,73.43 89.83,73.43 U$11.17 | v111.54,46.12 114.72,42.95 v118.27,42.95
P2_LED2  (via drill 0.35)
  Top 0.152: v242.1,51.71 239.94,53.87 239.94,64.03 U$12.7
  Bottom 0.152: R17.2 288.33,33.68 287.44,34.56 259.24,34.56 v242.1,51.71
SCK  (via drill 0.35)
  Top 0.152: P1_LCD.SD_SCK 38.14,42.11 38.14,36.85 48.87,26.12 U$1.PA2 | U$11.5 74.08,62.76 56.93,62.76 54.77,60.6 v43.98,60.6
  Bottom 0.152: P1_LCD.SD_SCK 40.67,44.78 47.76,51.87 47.76,60.62 47.15,61.23 U$7.7 44.61,61.23 v43.98,60.6 | U$11.5 83.48,71.78 104.3,50.95 112.56,50.95 120.05,43.45 122.85,43.45 124.5,41.8 124.5,40.79 123.27,39.56 P1_LCD.SCK
SCK2
  Top 0.152: U$12.15 246.42,58.82 264.28,40.96 P2_LCD.SCK

### Text on the board
tPlace: START | START | A | A | B | B | EE319H | EE319H | Allen Jiang / Jason Math | Allen Jiang / Jason Math
bPlace: Good Morning Gamers | Good Morning Gamers